# EAGLE schematic Expert Trade Solutions T-Stat 1.0 v7 (EAGLE 9.7.0)
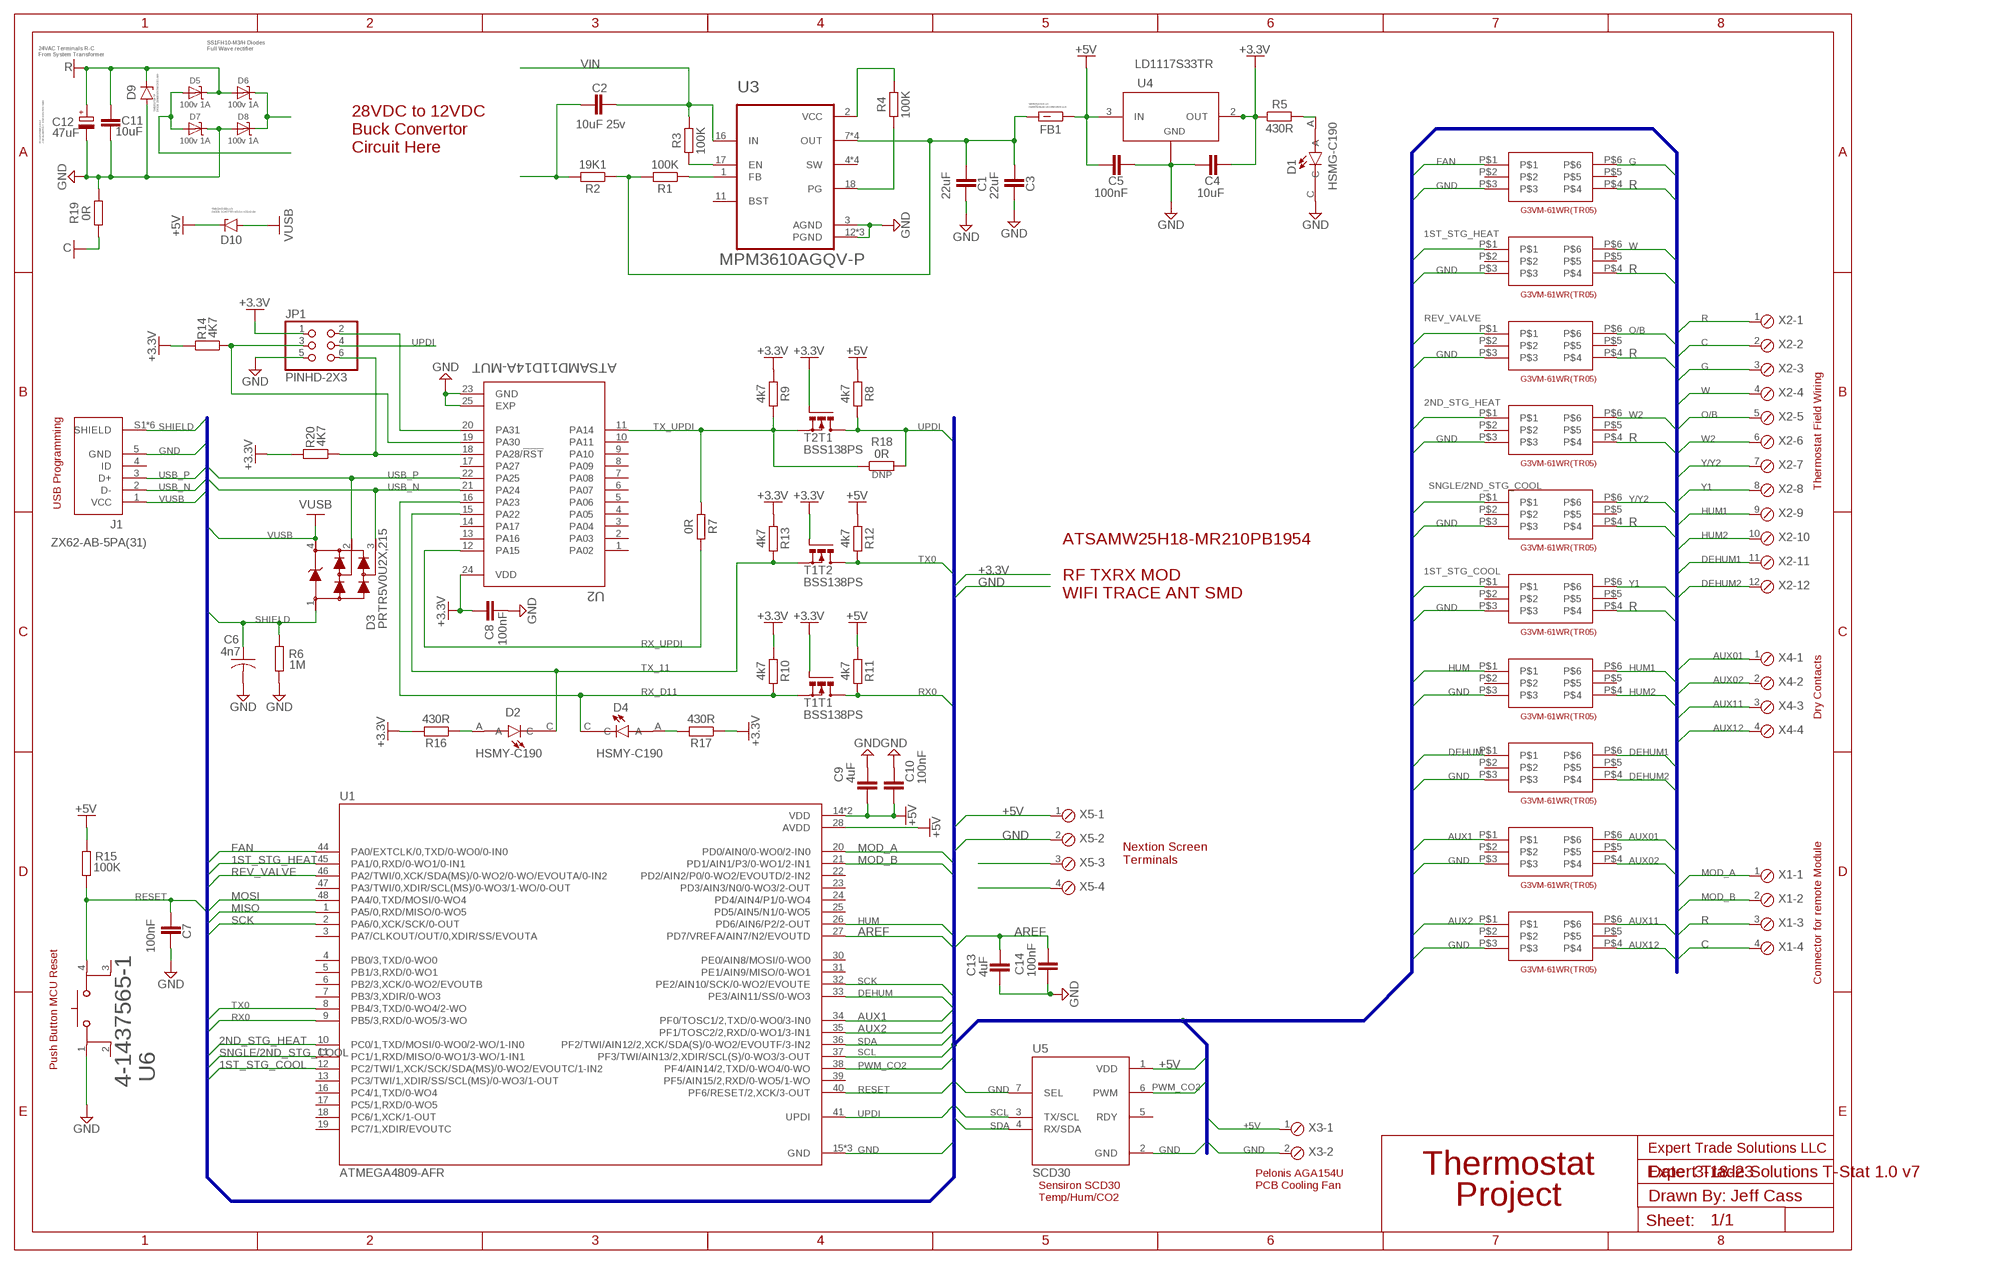
[diagram p0: schematic, sheet 1]

## Parts
C1  22uF  C_CHIP-0805(2012-METRIC)  [CAPC2012X110]
C2  10uF 25v  C_CHIP-0805(2012-METRIC)  [CAPC2012X110]
C3  22uF  C_CHIP-0805(2012-METRIC)  [CAPC2012X110]
C4  10uF  C_CHIP-0805(2012-METRIC)  [CAPC2012X110]
C5  100nF  C_CHIP-0805(2012-METRIC)  [CAPC2012X110]
C6  4n7  C-US_CHIP-0805(2012-METRIC)  [CAPC2012X110]
C7  100nF  C_CHIP-0805(2012-METRIC)  [CAPC2012X110]
C8  100nF  C_CHIP-0805(2012-METRIC)  [CAPC2012X110]
C9  4uF  C_CHIP-0805(2012-METRIC)  [CAPC2012X110]
C10  100nF  C_CHIP-0805(2012-METRIC)  [CAPC2012X110]
C11  10uF  C_CHIP-0805(2012-METRIC)  [CAPC2012X110]
C12  47uF  C-POL_ECAP-10.5MM  [CAPAE1030X1050N]
C13  4uF  C_CHIP-0805(2012-METRIC)  [CAPC2012X110]
C14  100nF  C_CHIP-0805(2012-METRIC)  [CAPC2012X110]
D1  HSMG-C190  [LEDM1608X80]
D2  HSMY-C190  [LEDM1608X80]
D3  PRTR5V0U2X,215  [SOT143B]
D4  HSMY-C190  [LEDM1608X80]
D5  100v 1A  DIODE-SCHOTTKYSOD-123  [SOD-123]
D6  100v 1A  DIODE-SCHOTTKYSOD-123  [SOD-123]
D7  100v 1A  DIODE-SCHOTTKYSOD-123  [SOD-123]
D8  100v 1A  DIODE-SCHOTTKYSOD-123  [SOD-123]
D9  ZENER  ZENER_DO-219-AB(SOD123F)  [SODFL3718X115]
D10  MMSZ5240BT1G  ZENER_MMSZ5240BTDO-219-AB(SOD123F)  [SODFL3718X115]
FB1  FERRITE_BEAD  FBCHIP-0805(2012-METRIC)  [BEADC2012X105N]
J1  ZX62-AB-5PA(31)  [HIROSE_ZX62-AB-5PA(31)]
JP1  PINHD-2X3  [2X03]
R1  100K  R_CHIP-0805(2012-METRIC)  [RESC2012X65]
R2  19K1  R_CHIP-0805(2012-METRIC)  [RESC2012X65]
R3  100K  R_CHIP-0805(2012-METRIC)  [RESC2012X65]
R4  100K  R_CHIP-0805(2012-METRIC)  [RESC2012X65]
R5  430R  R_CHIP-0805(2012-METRIC)  [RESC2012X65]
R6  1M  R_CHIP-0805(2012-METRIC)  [RESC2012X65]
R7  0R  R_CHIP-0805(2012-METRIC)  [RESC2012X65]
R8  4k7  R_CHIP-0805(2012-METRIC)  [RESC2012X65]
R9  4k7  R_CHIP-0805(2012-METRIC)  [RESC2012X65]
R10  4k7  R_CHIP-0805(2012-METRIC)  [RESC2012X65]
R11  4k7  R_CHIP-0805(2012-METRIC)  [RESC2012X65]
R12  4k7  R_CHIP-0805(2012-METRIC)  [RESC2012X65]
R13  4k7  R_CHIP-0805(2012-METRIC)  [RESC2012X65]
R14  4K7  R_CHIP-0805(2012-METRIC)  [RESC2012X65]
R15  100K  R_CHIP-0805(2012-METRIC)  [RESC2012X65]
R16  430R  R_CHIP-0805(2012-METRIC)  [RESC2012X65]
R17  430R  R_CHIP-0805(2012-METRIC)  [RESC2012X65]
R18  0R  R_CHIP-0805(2012-METRIC)  [RESC2012X65]
R19  0R  R_CHIP-0805(2012-METRIC)  [RESC2012X65]
R20  4K7  R_CHIP-0805(2012-METRIC)  [RESC2012X65]
T1  BSS138PS  [SOT363]
T2  BSS138PS  [SOT363]
U1  ATMEGA4809-AFR  [QFP50P900X900X120-48N]
U2  ATSAMD11D14A-MUT  [QFN50P400X400X90-25N]
U3  MPM3610AGQV-P  [CONV_MPM3620AGQV-P]
U4  LD1117S33TR  [SOT-223]
U5  SCD30  [MODULE_SCD30]
U6  4-1437565-1  [SW4_236X236H5MM]
U$1  G3VM-61E1  [G3VM-61E1]
U$2  G3VM-61E1  [G3VM-61E1]
U$3  G3VM-61E1  [G3VM-61E1]
U$4  G3VM-61E1  [G3VM-61E1]
U$5  G3VM-61E1  [G3VM-61E1]
U$6  G3VM-61E1  [G3VM-61E1]
U$7  G3VM-61E1  [G3VM-61E1]
U$8  G3VM-61E1  [G3VM-61E1]
U$9  G3VM-61E1  [G3VM-61E1]
U$10  G3VM-61E1  [G3VM-61E1]
X1  MPT4  [4POL254]
X2  MPT12  [12POL254]
X3  MPT2  [2POL254]
X4  MPT4  [4POL254]
X5  MPT4  [4POL254]

## Nets
1ST_STG_COOL: U1.12(PC2/TWI/1,XCK/SCK/SDA(MS)/0-WO2/EVOUTC/1-IN2) U$5.P$1
1ST_STG_HEAT: U1.45(PA1/0,RXD/0-WO1/0-IN1) U$8.P$1
2ND_STG_HEAT: U1.10(PC0/1,TXD/MOSI/0-WO0/2-WO/1-IN0) U$10.P$1
+3.3V: C4.1 C8.2 JP1.1 R5.1 R9.1 R10.1 R13.1 R14.2 R16.2 R17.1 R20.2 T1.2(T1:G) T1.5(T2:G) T2.2(T1:G) U2.24(VDD) U4.2(OUT) U4.4
+5V: C5.2 C9.2 C10.2 D10.1(C) FB1.1 R8.1 R11.1 R12.1 R15.2 U1.14(VDD) U1.28(AVDD) U1.42(VDD) U4.3(IN) U5.1(VDD) X3.1 X5.1
AREF: C13.1 C14.1 U1.27(PD7/VREFA/AIN7/N2/EVOUTD)
AUX01: U$2.P$6 X4.1
AUX1: U1.34(PF0/TOSC1/2,TXD/0-WO0/3-IN0) U$2.P$1
AUX02: U$2.P$4 X4.2
AUX2: U1.35(PF1/TOSC2/2,RXD/0-WO1/3-IN1) U$1.P$1
AUX11: U$1.P$6 X4.3
AUX12: U$1.P$4 X4.4
C: R19.1 X1.4 X2.2
DEHUM: U1.33(PE3/AIN11/SS/0-WO3) U$3.P$1
DEHUM1: U$3.P$6 X2.11
DEHUM2: U$3.P$4 X2.12
FAN: U1.44(PA0/EXTCLK/0,TXD/0-WO0/0-IN0) U$7.P$1
G: U$7.P$6 X2.3
GND: C1.2 C3.2 C4.2 C5.1 C6.2 C7.2 C8.1 C9.1 C10.1 C11.2 C12.2(-) C13.2 C14.2 D1.C D7.C D8.A D9.2(A) J1.5(GND) JP1.5 R6.1 R19.2 U1.15(GND) U1.29(GND) U1.43(GND) U2.23(GND) U2.25(EXP) U3.3(AGND) U3.12(PGND) U3.13(PGND) U3.14(PGND) U4.1(ADJ/GND) U5.2(GND) U5.7(SEL) U6.1 U$1.P$3 U$2.P$3 U$3.P$3 U$4.P$3 U$5.P$3 U$6.P$3 U$7.P$3 U$8.P$3 U$9.P$3 U$10.P$3 X3.2 X5.2
HUM: U1.26(PD6/AIN6/P2/2-OUT) U$4.P$1
HUM1: U$4.P$6 X2.9
HUM2: U$4.P$4 X2.10
MISO: U1.1(PA5/0,RXD/MISO/0-WO5)
MOD_A: U1.20(PD0/AIN0/0-WO0/2-IN0) X1.1
MOD_B: U1.21(PD1/AIN1/P3/0-WO1/2-IN1) X1.2
MOSI: U1.48(PA4/0,TXD/MOSI/0-WO4)
N$1: D5.A D7.A
N$2: R1.1 U3.1(FB)
N$3: R3.1 U3.17(EN)
N$4: JP1.6 R20.1 U2.18(PA28/!RST)
N$5: C2.1 R2.2
N$6: D1.A R5.2
N$7: R4.1 U3.18(PG)
N$8: R4.2 U3.2(VCC)
N$10: JP1.2 U2.20(PA31)
N$11: JP1.3 R14.1 U2.19(PA30)
N$12: D4.A R17.2
N$13: D2.A R16.1
N$14: C1.1 C3.1 FB1.2 R1.2 R2.1 U3.7(OUT) U3.8(OUT) U3.9(OUT) U3.20(OUT)
N$15: D6.C D8.C
N$16: X5.4
N$17: X5.3
O/B: U$9.P$6 X2.5
PWM_CO2: U1.38(PF4/AIN14/2,TXD/0-WO4/0-WO) U5.6(PWM)
R: C11.1 C12.1(+) D5.C D6.A D9.1(C) U$5.P$4 U$6.P$4 U$7.P$4 U$8.P$4 U$9.P$4 U$10.P$4 X1.3 X2.1
RESET: C7.1 R15.1 U1.40(PF6/RESET/2,XCK/3-OUT) U6.4
REV_VALVE: U1.46(PA2/TWI/0,XCK/SDA(MS)/0-WO2/0-WO/EVOUTA/0-IN2) U$9.P$1
RX0: R11.2 T1.6(T1:D) U1.9(PB5/3,RXD/0-WO5/3-WO)
RX_D11: D4.C R10.2 T1.1(T1:S) U2.16(PA23)
RX_UPDI: R7.2 U2.12(PA15)
SCK: U1.2(PA6/0,XCK/SCK/0-OUT) U1.32(PE2/AIN10/SCK/0-WO2/EVOUTE)
SCL: U1.37(PF3/TWI/AIN13/2,XDIR/SCL(S)/0-WO3/3-OUT) U5.3(TX/SCL)
SDA: U1.36(PF2/TWI/AIN12/2,XCK/SDA(S)/0-WO2/EVOUTF/3-IN2) U5.4(RX/SDA)
SHIELD: C6.1 D3.1 J1.S1(SHIELD) J1.S2(SHIELD) J1.S3(SHIELD) J1.S4(SHIELD) J1.S5(SHIELD) J1.S6(SHIELD) R6.2
SNGLE/2ND_STG_COOL: U1.11(PC1/1,RXD/MISO/0-WO1/3-WO/1-IN1) U$6.P$1
TX0: R12.2 T1.3(T2:D) U1.8(PB4/3,TXD/0-WO4/2-WO)
TX_11: D2.C R13.2 T1.4(T2:S) U2.15(PA22)
TX_UPDI: R7.1 R9.2 R18.1 T2.1(T1:S) U2.11(PA14)
UPDI: JP1.4 R8.2 R18.2 T2.6(T1:D) U1.41(UPDI)
USB_N: D3.3 J1.2(D-) U2.21(PA24)
USB_P: D3.2 J1.3(D+) U2.22(PA25)
VIN: C2.2 R3.2 U3.16(IN)
VUSB: D3.4 D10.2(A) J1.1(VCC)
W: U$8.P$6 X2.4
W2: U$10.P$6 X2.6
Y1: U$5.P$6 X2.8
Y/Y2: U$6.P$6 X2.7
Unconnected: J1.4(ID) T2.3(T2:D) T2.4(T2:S) T2.5(T2:G) U1.3(PA7/CLKOUT/OUT/0,XDIR/SS/EVOUTA) U1.4(PB0/3,TXD/0-WO0) U1.5(PB1/3,RXD/0-WO1) U1.6(PB2/3,XCK/0-WO2/EVOUTB) U1.7(PB3/3,XDIR/0-WO3) U1.13(PC3/TWI/1,XDIR/SS/SCL(MS)/0-WO3/1-OUT) U1.16(PC4/1,TXD/0-WO4) U1.17(PC5/1,RXD/0-WO5) U1.18(PC6/1,XCK/1-OUT) U1.19(PC7/1,XDIR/EVOUTC) U1.22(PD2/AIN2/P0/0-WO2/EVOUTD/2-IN2) U1.23(PD3/AIN3/N0/0-WO3/2-OUT) U1.24(PD4/AIN4/P1/0-WO4) U1.25(PD5/AIN5/N1/0-WO5) U1.30(PE0/AIN8/MOSI/0-WO0) U1.31(PE1/AIN9/MISO/0-WO1) U1.39(PF5/AIN15/2,RXD/0-WO5/1-WO) U1.47(PA3/TWI/0,XDIR/SCL(MS)/0-WO3/1-WO/0-OUT) U2.1(PA02) U2.2(PA03) U2.3(PA04) U2.4(PA05) U2.5(PA06) U2.6(PA07) U2.7(PA08) U2.8(PA09) U2.9(PA10) U2.10(PA11) U2.13(PA16) U2.14(PA17) U2.17(PA27) U3.4(SW) U3.5(SW) U3.6(SW) U3.11(BST) U3.19(SW) U5.5(RDY) U6.2 U6.3 U$1.P$2 U$1.P$5 U$2.P$2 U$2.P$5 U$3.P$2 U$3.P$5 U$4.P$2 U$4.P$5 U$5.P$2 U$5.P$5 U$6.P$2 U$6.P$5 U$7.P$2 U$7.P$5 U$8.P$2 U$8.P$5 U$9.P$2 U$9.P$5 U$10.P$2 U$10.P$5

## Buses
1ST_STG_COOL,1ST_STG_HEAT,2ND_STG_HEAT,+3.3V,+5V,AREF,AUX01,AUX1,AUX02,AUX2,AUX11,AUX12,C,DEHUM,DEHUM1,DEHUM2,FAN,G,GND,HUM,HUM1,HUM2,MISO,MOD_-12V,MOD_+12V,MOD_A,MOD_B,MOSI,O/B,PWM_CO2,R,RESET,REV_VALVE,RX0,SCK,SCL,SDA,SHIELD,SNGLE/2ND_STG_COOL,TX0,UPDI,USB_N,USB_P,VUSB,W,W2,Y1,Y/Y2

## Notes on the sheet
- 24VAC Terminals R-C
  From System Transformer
- SS1FH10-M3/H Diodes 
  Full Wave rectifier
- MI0805J102R-10
  FERRITE BEAD 1K OHM 0805 1LN
- SMBJ5371B-TP
  DIODE ZENER 60V 5W DO214AA
- PCV1H470MCL2GS
  CAP ALUM POLY 47UF 20% 50V SMD
- 28VDC to 12VDC
  Buck Convertor
  Circuit Here
- PMEG6020ER,115
  DIODE SCHOTTKY 60V 2A SOD123W
- G3VM-61WR(TR05)
- G3VM-61WR(TR05)
- G3VM-61WR(TR05)
- G3VM-61WR(TR05)
- DNP
- Thermostat Field Wiring
- USB Programming
- G3VM-61WR(TR05)
- ATSAMW25H18-MR210PB1954
  
  RF TXRX MOD
  WIFI TRACE ANT SMD
- G3VM-61WR(TR05)
- G3VM-61WR(TR05) | Dry Contacts
- G3VM-61WR(TR05)
- Nextion Screen
  Terminals
- G3VM-61WR(TR05)
- G3VM-61WR(TR05)
- Connector for remote Module
- Push Button MCU Reset
- Expert Trade Solutions LLC
- Pelonis AGA154U | Date: 3-18-23
- PCB Cooling Fan
- Sensiron SCD30
  Temp/Hum/CO2
- Drawn By: Jeff Cass
- Thermostat
  Project

## Library data of the parts
C1-C5 C7-C11 C13 C14 = Capacitor:C: Capacitor - Generic; CATEGORY: Capacitor
C6 = Capacitor:C-US: Capacitor - ANSI; CATEGORY: Capacitor
C12 = Capacitor:C-POL: Capacitor Polarised - Generic; CATEGORY: Capacitor
D1 = HSMG-C190:HSMG-C190: LED Uni-Color Green 570nm 2-Pin Chip LED T/R; MANUFACTURER: Avago Technologies
D2 D4 = HSMY-C190:HSMY-C190: LED Uni-Color Yellow 589nm 2-Pin Chip LED T/R; MANUFACTURER: Avago Technologies
D3 = PRTR5V0U2X_215:PRTR5V0U2X,215: Ultra low capacitance double rail-to-rail ESD protection diode Check availability <https://pricing.snapeda.com/parts/PRTR5V0U2X%2C215/Nexperia%20USA%20Inc./view-part?ref=eda>; AVAILABILITY: In Stock; DESCRIPTION: - Clamp - Ipp Tvs Diode Surface Mount SOT-143B; MF: Nexperia USA Inc.; MP: PRTR5V0U2X,215; PACKAGE: TO-253-4 Nexperia USA Inc.; PRICE: None; PURCHASE-URL: https://pricing.snapeda.com/search/part/PRTR5V0U2X,215/?ref=eda
D5-D8 = Airquality_Sensor:DIODE-SCHOTTKY
D9 = Diode:ZENER: Zener Diode - Generic; CATEGORY: Diode; SUB-CATEGORY: Zener
D10 = Diode:ZENER_: Zener Diode - Popular parts; CATEGORY: Diode; DESCRIPTION: DIODE ZENER 10V 500MW SOD123; MANUFACTURER: ON Semiconductor; MPN: MMSZ5240BT1G; SUB-CATEGORY: Zener; THERMALLOSS: 0.5W
FB1 = Filter:FB: Ferrite Bead - Generic; CATEGORY: Filter; SUB-CATEGORY: Ferrite bead
J1 = ZX62-AB-5PA_31_:ZX62-AB-5PA(31): USB - micro AB USB 2.0 Receptacle Connector 5 Position Surface Mount, Right Angle Check availability <https://pricing.snapeda.com/parts/ZX62-AB-5PA%2831%29/Hirose%20Electric/view-part?ref=eda>; AVAILABILITY: In Stock; DESCRIPTION: USB - micro AB USB 2.0 Receptacle Connector 5 Position Surface Mount, Right Angle; MF: Hirose Electric; MP: ZX62-AB-5PA(31); PACKAGE: None; PRICE: None; PURCHASE-URL: https://pricing.snapeda.com/search/part/ZX62-AB-5PA(31)/?ref=eda
JP1 = Connector:PINHD-2X3: PIN HEADER; CATEGORY: CONNECTOR; SUB-CATEGORY: PIN-HEADER
R1-R20 = Resistor:R: Resistor Fixed - Generic; CATEGORY: Resistor; SUB-CATEGORY: Fixed
T1 T2 = BSS138PS:BSS138PS: Check availability <https://pricing.snapeda.com/parts/BSS138PS/NXP%20Semiconductors/view-part?ref=eda>; AVAILABILITY: In Stock; DESCRIPTION: Mosfet Array 2 N-Channel (Dual) 60V 320mA 420mW Surface Mount 6-TSSOP; MF: NXP Semiconductors; MP: BSS138PS; PACKAGE: SOT-363 Nexperia USA; PRICE: None; PURCHASE-URL: https://pricing.snapeda.com/search/part/BSS138PS/?ref=eda
U1 = ATMEGA4809-AFR:ATMEGA4809-AFR: 20MHz 48KB TQFP48 Ind 125C Green T&R Check availability <https://pricing.snapeda.com/parts/ATMEGA4809-AFR/Microchip/view-part?ref=eda>; AVAILABILITY: In Stock; DESCRIPTION: AVR megaAVR® 0, Functional Safety (FuSa) Microcontroller IC 8-Bit 20MHz 48KB (48K x 8) FLASH 48-TQFP (7x7); MF: Microchip; MP: ATMEGA4809-AFR; PACKAGE: TQFP-48 Microchip; PRICE: None; PURCHASE-URL: https://pricing.snapeda.com/search/part/ATMEGA4809-AFR/?ref=eda
U2 = ATSAMD11D14A-MUT:ATSAMD11D14A-MUT: None Buy Part <https://snapeda.com/parts/ATSAMD11D14A-MUT/Microchip/view-part/?ref=eda> Check availability <https://pricing.snapeda.com/parts/ATSAMD11D14A-MUT/Microchip/view-part?ref=eda>; AVAILABILITY: In Stock; DESCRIPTION: ARM® Cortex®-M0+ SAM D11D Microcontroller IC 32-Bit Single-Core 48MHz 16KB (16K x 8) FLASH 24-QFN (4x4); MF: Microchip; MP: ATSAMD11D14A-MUT; PACKAGE: QFN-24 Microchip; PRICE: None; PURCHASE-URL: https://pricing.snapeda.com/search/part/ATSAMD11D14A-MUT/?ref=eda
U3 = MPM3610AGQV-P:MPM3610AGQV-P: MPM3610A Series 21 V 1.2 A Adj. SMT Synchronous Step-Down Converter - QFN-20 Check availability <https://pricing.snapeda.com/parts/MPM3610AGQV-P/Monolithic%20Power/view-part?ref=eda>; AVAILABILITY: In Stock; DESCRIPTION: Non-Isolated PoL Module DC DC Converter 1 Output 0.8 ~ 18.48V - - - 1.2A 4.5V - 21V Input; MF: Monolithic Power; MP: MPM3610AGQV-P; PACKAGE: QFN-20 Monolithic Power Systems; PRICE: None; PURCHASE-URL: https://pricing.snapeda.com/search/part/MPM3610AGQV-P/?ref=eda
U4 = IC:LD1117S33TR: IC REG LINEAR 3.3V 800MA SOT223 Manufacturer's datasheet <http://www.st.com/content/ccc/resource/technical/document/datasheet/99/3b/7d/91/91/51/4b/be/CD00000544.pdf/files/CD00000544.pdf/jcr:content/translations/en.CD00000544.pdf>; CREATED_BY: PCBLayout.com; DIGIKEY_PART_NUMBER: 497-1242-2-ND; MANUFACTURER: STMicroelectronics; MPN: LD1117S33TR; PACKAGE: SOT-223
U5 = SCD30:SCD30: SCD30 Series 5.5 V 75 mA ±3% Carbon Dioxide (CO2) Sensor Module Check availability <https://pricing.snapeda.com/parts/SCD30/Sensirion%20AG/view-part?ref=eda>; AVAILABILITY: In Stock; DESCRIPTION: Carbon Dioxide (CO2) Sensor I²C, Modbus, PWM; MF: Sensirion AG; MP: SCD30; PACKAGE: None; PRICE: None; PURCHASE-URL: https://pricing.snapeda.com/search/part/SCD30/?ref=eda
U6 = Switches:4-1437565-1; BUILT_BY: EMA_UL_Team; CATEGORY: Tactile Switches; COPYRIGHT: Copyright (C) 2016 Accelerated Designs. All rights reserved; DESCRIPTION: FSM4JSMA=SMT,TACTILE,PB SWITCH; MANUFACTURER_PART_NUMBER: 4-1437565-1; PART_STATUS: active; SERIES: Alcoswitch FSMJSMA; VENDOR: TE Connectivity
U$1-U$10 = G3VM-61E1:G3VM-61E1: Omron NO solid state relay Check availability <https://pricing.snapeda.com/parts/G3VM-61E1/Omron/view-part?ref=eda>; AVAILABILITY: In Stock; DESCRIPTION: Solid State SPST-NO (1 Form A) 6-SMD (0.300, 7.62mm); MF: Omron; MP: G3VM-61E1; PACKAGE: None; PRICE: None; PURCHASE-URL: https://pricing.snapeda.com/search/part/G3VM-61E1/?ref=eda
X1 X4 X5 = con-phoenix-254:MPT4: PHOENIX CONNECTOR; OC_FARNELL: unknown; OC_NEWARK: unknown
X2 = con-phoenix-254:MPT12: PHOENIX CONNECTOR; OC_FARNELL: unknown; OC_NEWARK: unknown
X3 = con-phoenix-254:MPT2: PHOENIX CONNECTOR; OC_FARNELL: unknown; OC_NEWARK: unknown